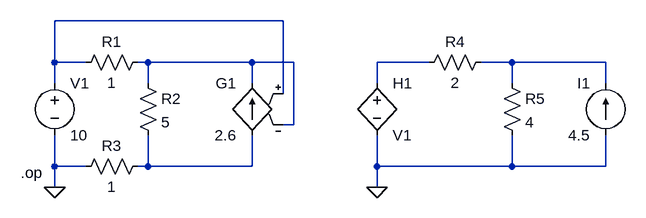
[diagram p0: schematic VCCS_and_CCVS.asc]
VCCS_and_CCVS.asc, the LTspice schematic file:
Version 4
SHEET 1 932 680
WIRE 400 64 48 64
WIRE 48 128 48 64
WIRE 96 128 48 128
WIRE 192 128 176 128
WIRE 352 128 192 128
WIRE 416 128 352 128
WIRE 624 128 544 128
WIRE 752 128 704 128
WIRE 896 128 752 128
WIRE 48 160 48 128
WIRE 192 160 192 128
WIRE 352 160 352 128
WIRE 544 160 544 128
WIRE 752 160 752 128
WIRE 896 160 896 128
WIRE 400 176 400 64
WIRE 416 224 416 128
WIRE 416 224 400 224
WIRE 48 288 48 240
WIRE 96 288 48 288
WIRE 192 288 192 240
WIRE 192 288 176 288
WIRE 352 288 352 240
WIRE 352 288 192 288
WIRE 544 288 544 240
WIRE 752 288 752 240
WIRE 752 288 544 288
WIRE 896 288 896 240
WIRE 896 288 752 288
WIRE 48 320 48 288
WIRE 544 320 544 288
FLAG 48 320 0
FLAG 544 320 0
SYMBOL voltage 48 144 R0
WINDOW 123 0 0 Left 0
WINDOW 39 0 0 Left 0
SYMATTR InstName V1
SYMATTR Value 10
SYMBOL res 176 144 R0
SYMATTR InstName R2
SYMATTR Value 5
SYMBOL g 352 144 M0
SYMATTR InstName G1
SYMATTR Value 2.6
SYMBOL res 192 112 R90
WINDOW 0 0 56 VBottom 2
WINDOW 3 32 56 VTop 2
SYMATTR InstName R1
SYMATTR Value 1
SYMBOL res 192 272 R90
WINDOW 0 0 56 VBottom 2
WINDOW 3 32 56 VTop 2
SYMATTR InstName R3
SYMATTR Value 1
SYMBOL h 544 144 R0
SYMATTR InstName H1
SYMATTR Value V1
SYMATTR Value2 3
SYMBOL res 720 112 R90
WINDOW 0 0 56 VBottom 2
WINDOW 3 32 56 VTop 2
SYMATTR InstName R4
SYMATTR Value 2
SYMBOL res 736 144 R0
SYMATTR InstName R5
SYMATTR Value 4
SYMBOL current 896 240 R180
WINDOW 0 24 80 Left 2
WINDOW 3 24 0 Left 2
WINDOW 123 0 0 Left 0
WINDOW 39 0 0 Left 0
SYMATTR InstName I1
SYMATTR Value 4.5
TEXT -4 298 Left 2 !.op

The netlist it stands for:
* VCCS_and_CCVS.asc
V1 N001 0 10
R2 N002 N005 5
G1 N005 N002 N001 N002 2.6
R1 N002 N001 1
R3 N005 0 1
H1 N003 0 V1 3
R4 N004 N003 2
R5 N004 0 4
I1 0 N004 4.5
.op
.backanno
.end